# EAGLE design controller (EAGLE 9.3.0)
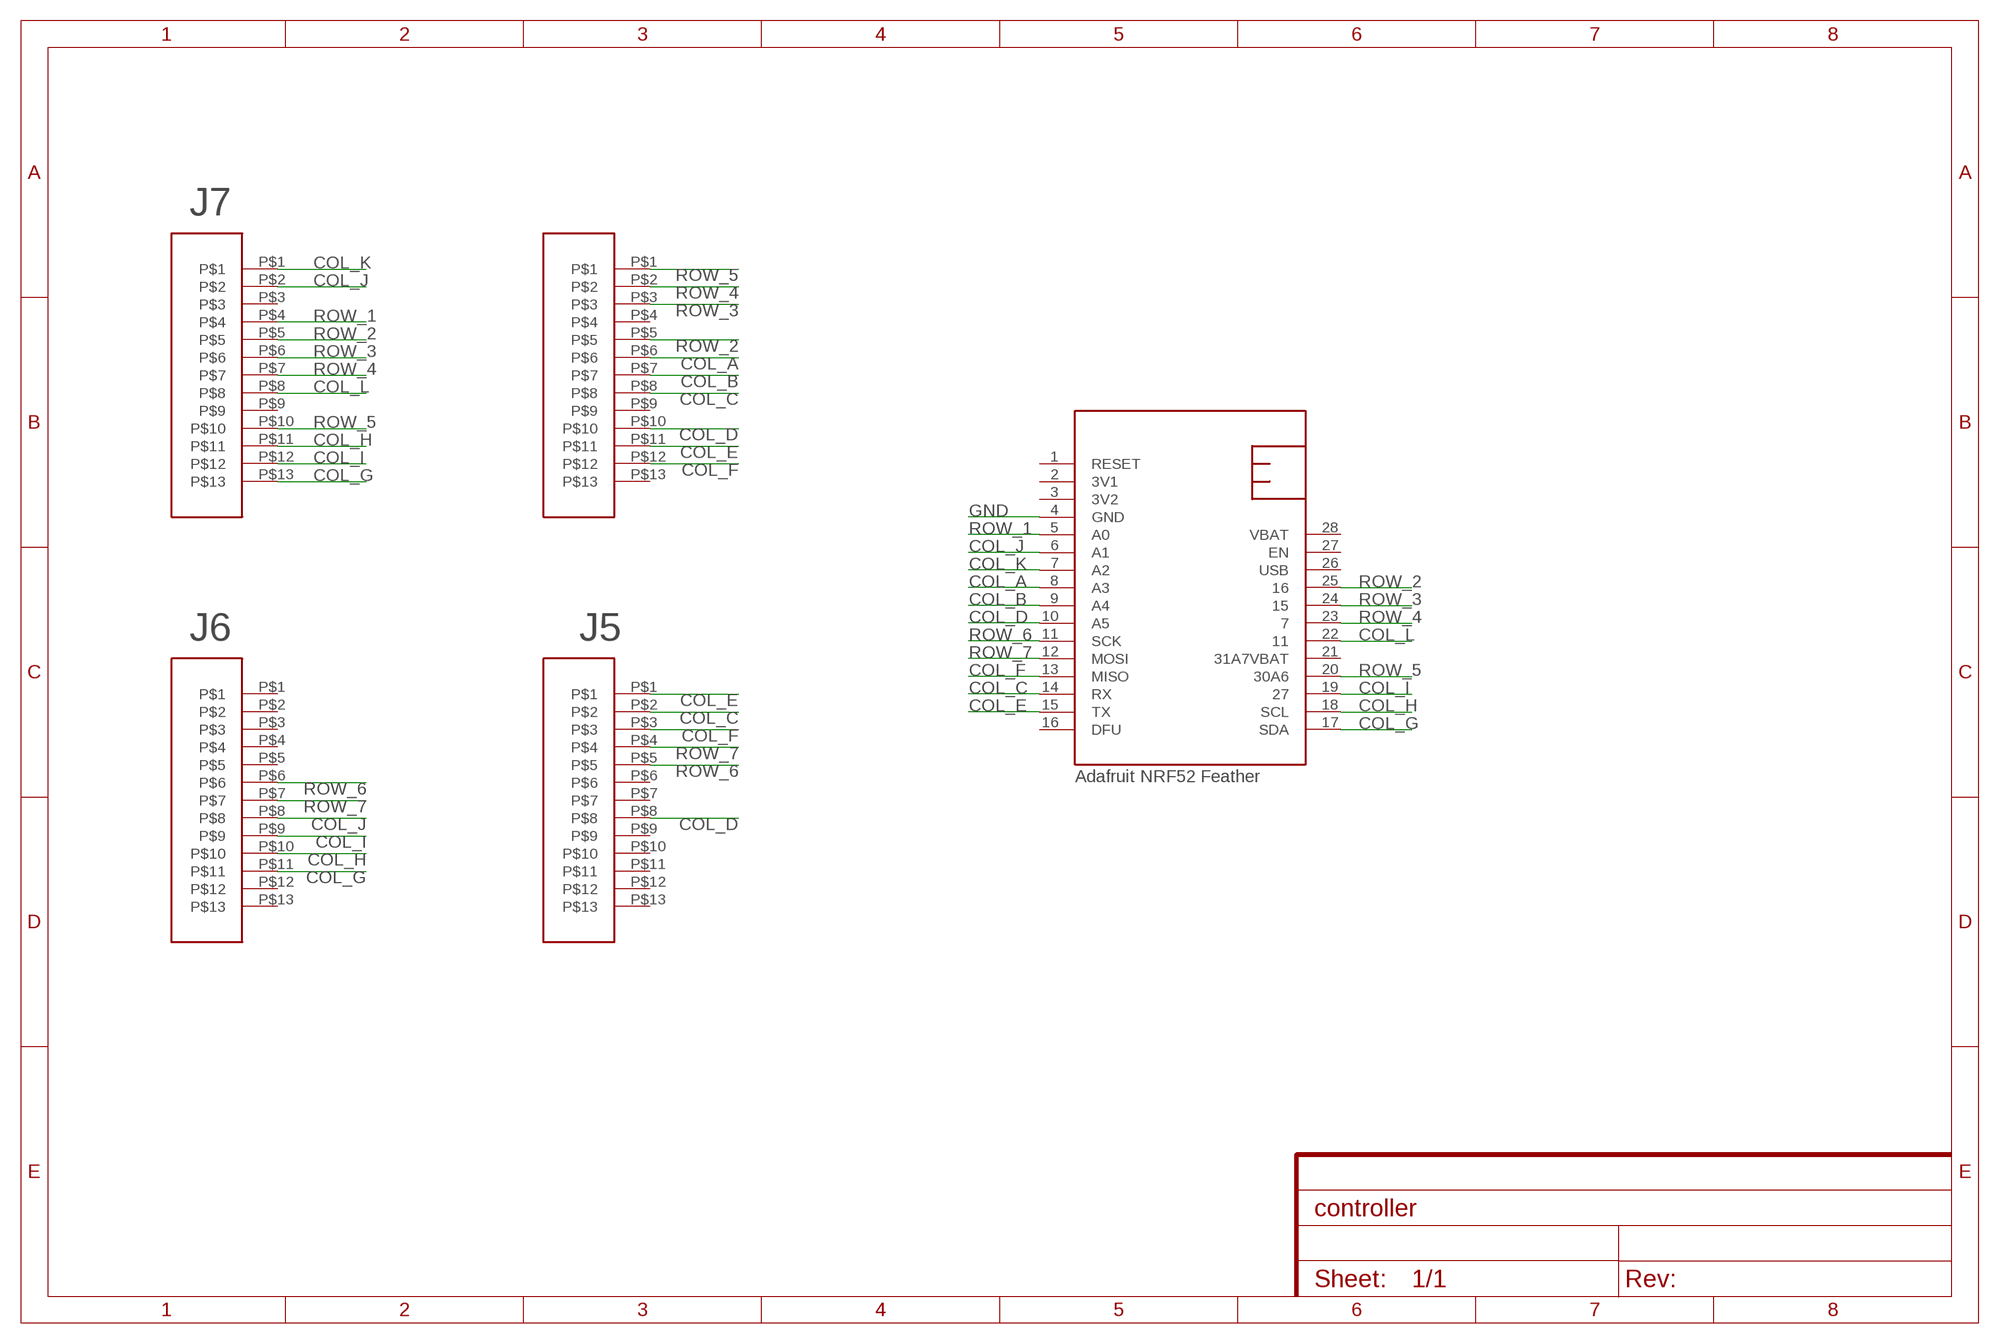
[diagram p0: schematic, sheet 1]

## Parts
U$1  NRF52FEATHER  [NRF52FEATHER]
U$4  TOPLINKS_STAPELBERG  [TOPLINKS_STAPELBERG]
U$5  TOPLINKS_STAPELBERG  [TOPLINKS_STAPELBERG]
U$6  TOPLINKS_STAPELBERG  [TOPLINKS_STAPELBERG]
U$7  TOPLINKS_STAPELBERG  [TOPLINKS_STAPELBERG]

## Nets
COL_A: U$1.8(A3) U$5.P$6
COL_B: U$1.9(A4) U$5.P$7
COL_C: U$1.14(RX) U$5.P$8 U$6.P$2
COL_D: U$1.10(A5) U$5.P$10 U$6.P$8
COL_E: U$1.15(TX) U$5.P$11 U$6.P$1
COL_F: U$1.13(MISO) U$5.P$12 U$6.P$3
COL_G: U$1.17(SDA) U$4.P$13 U$7.P$11
COL_H: U$1.18(SCL) U$4.P$11 U$7.P$10
COL_I: U$1.19 U$4.P$12 U$7.P$9
COL_J: U$1.6(A1) U$4.P$2 U$7.P$8
COL_K: U$1.7(A2) U$4.P$1
COL_L: U$1.22 U$4.P$8
GND: U$1.4(GND)
ROW_1: U$1.5(A0) U$4.P$4
ROW_2: U$1.25 U$4.P$5 U$5.P$5
ROW_3: U$1.24 U$4.P$6 U$5.P$3
ROW_4: U$1.23 U$4.P$7 U$5.P$2
ROW_5: U$1.20(30A6) U$4.P$10 U$5.P$1
ROW_6: U$1.11(SCK) U$6.P$5 U$7.P$6
ROW_7: U$1.12(MOSI) U$6.P$4 U$7.P$7
Unconnected: U$1.1(RESET) U$1.16(DFU) U$1.21(31A7VBAT) U$1.26(USB) U$1.27(EN) U$4.P$3 U$4.P$9 U$5.P$4 U$5.P$9 U$5.P$13 U$6.P$6 U$6.P$7 U$6.P$9 U$6.P$10 U$6.P$11 U$6.P$12 U$6.P$13 U$7.P$1 U$7.P$2 U$7.P$3 U$7.P$4 U$7.P$5 U$7.P$12 U$7.P$13

## Notes on the sheet
- J7
- J6 | J5
- Adafruit NRF52 Feather

## Power pins joined to a net without a drawn wire
3V1: U$1.2(3V1)
3V2: U$1.3(3V2)
VBAT: U$1.28(VBAT)

## Library data of the parts
U$1 = adafruit:NRF52FEATHER
U$4-U$7 = con-molex-39-53:TOPLINKS_STAPELBERG

## Board
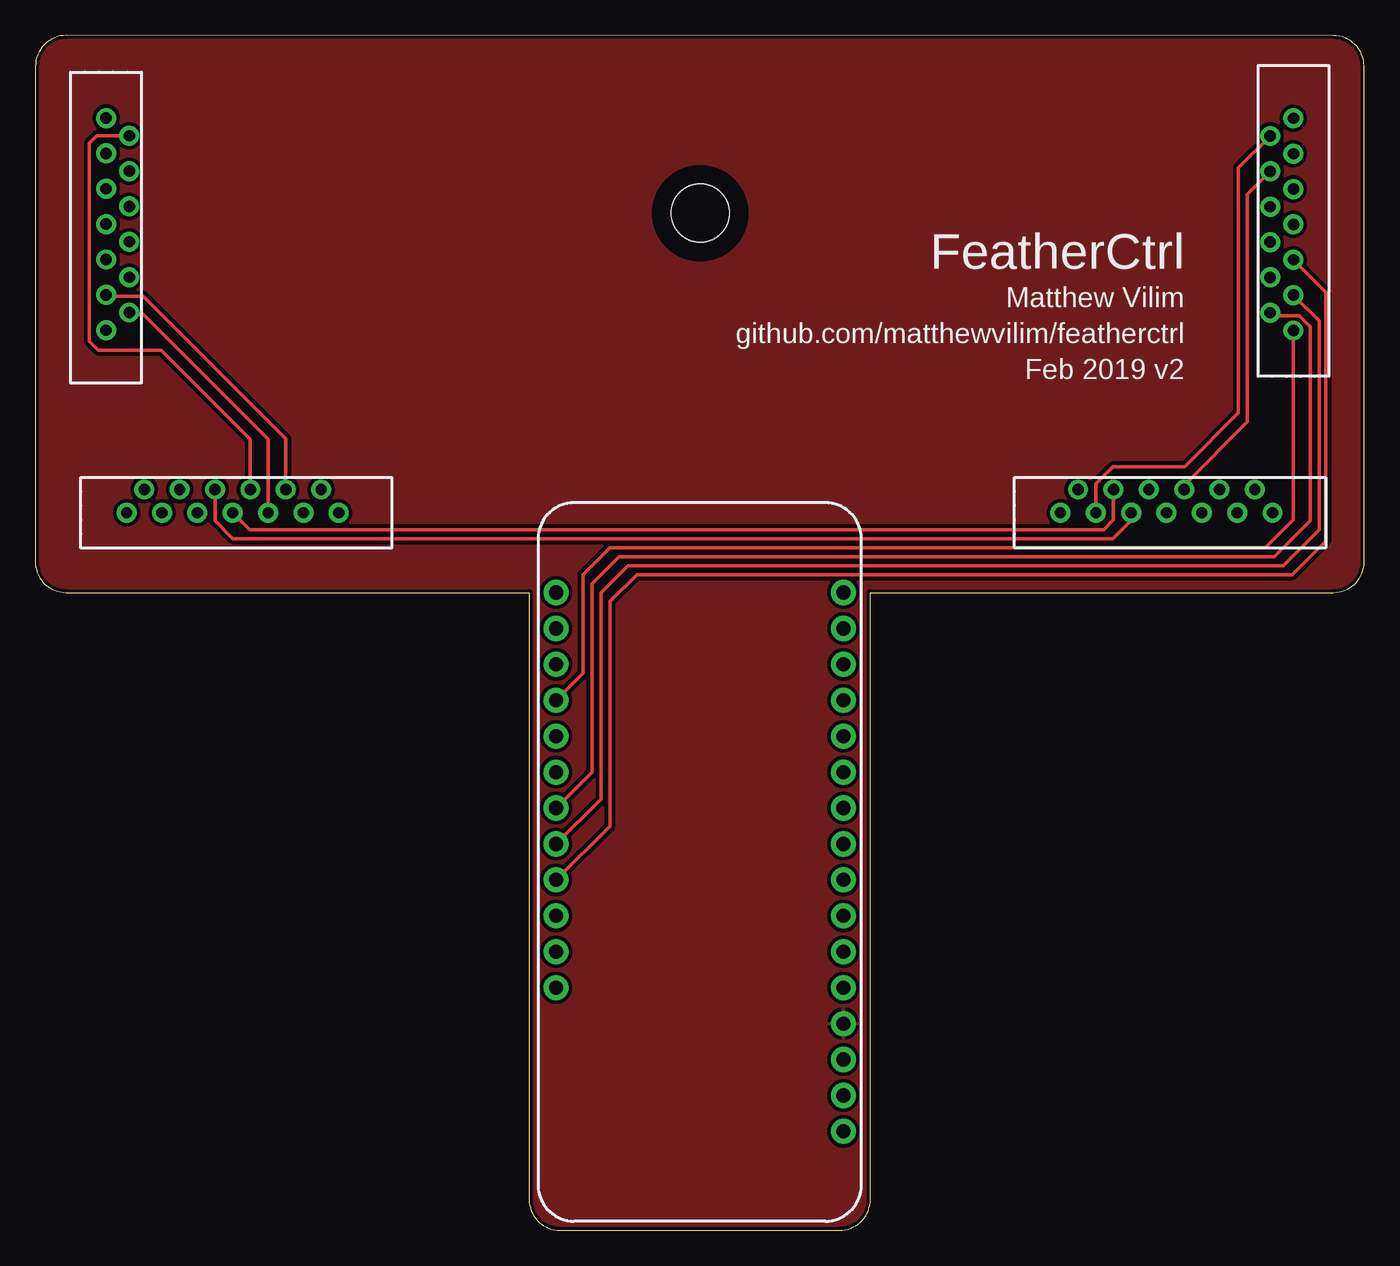
[diagram p1: board, top side]
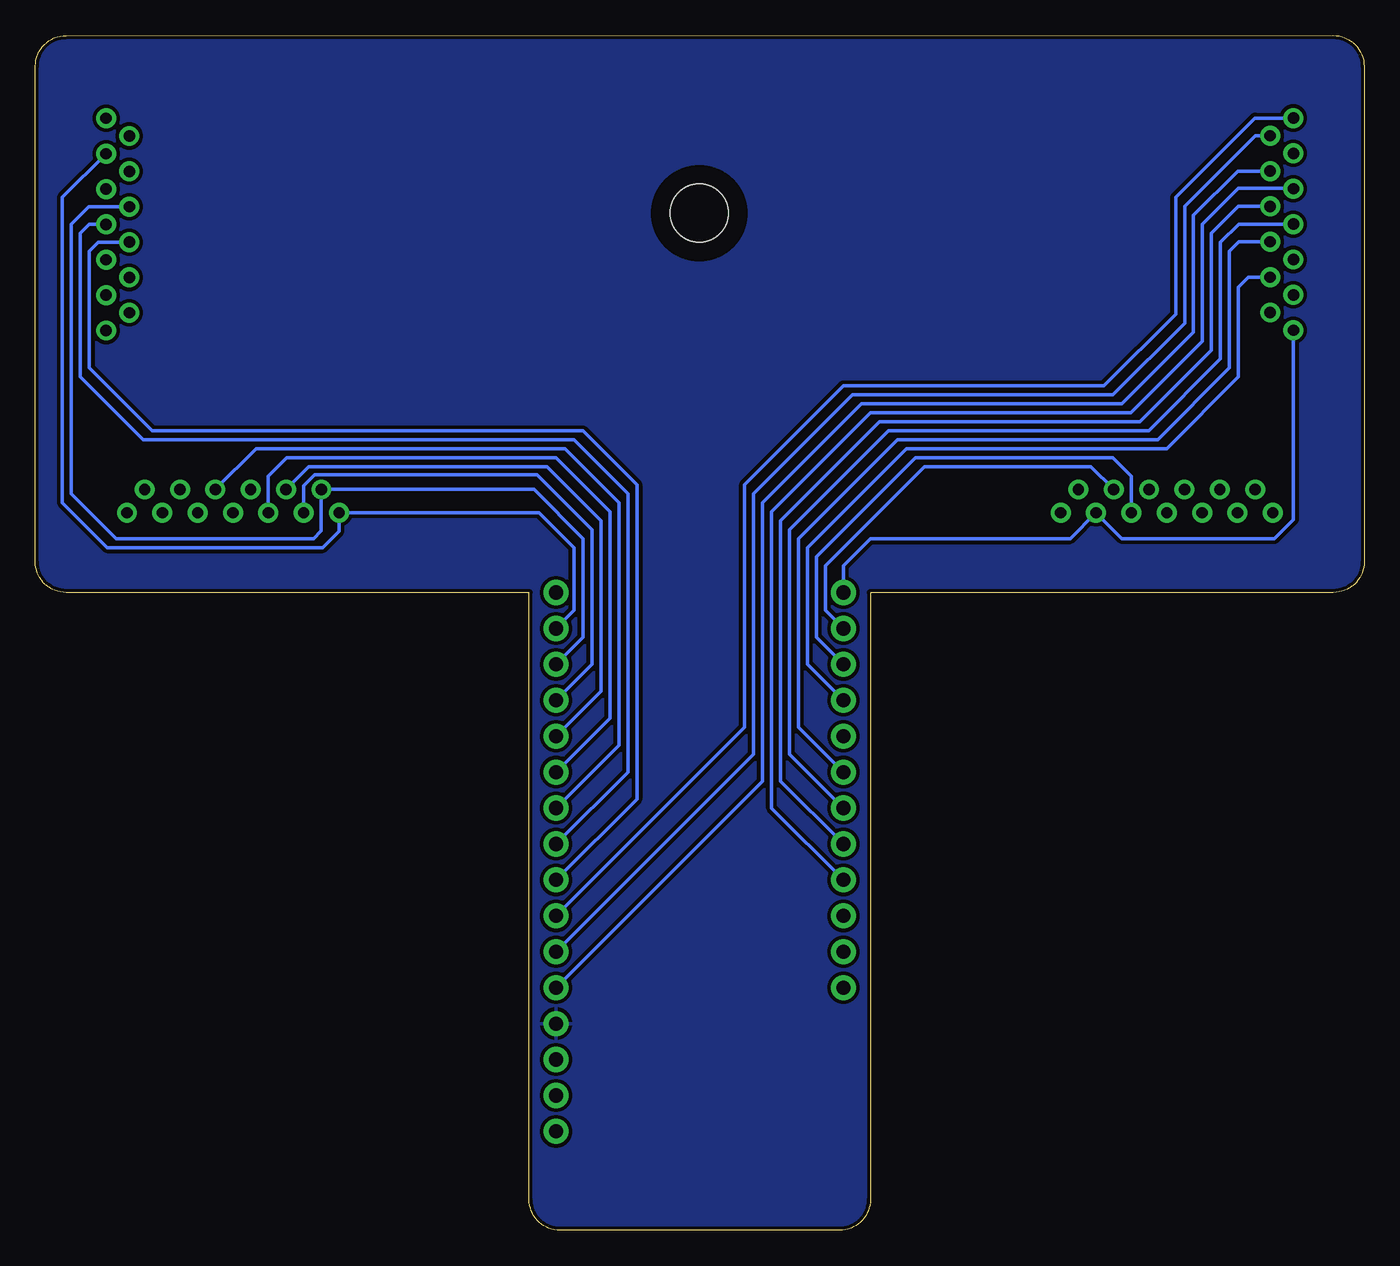
[diagram p2: board, bottom side, seen from below]

Size 93.98 x 84.48 mm. Coordinates in mm from the lower left corner, seen from the top.
Outline: 59.05,45.09 91.81,45.09 arc90 93.98,47.25 93.98,82.29 arc90 91.81,84.45 2.2,84.48 arc90 0,82.27 0,47.25 arc90 2.17,45.09 34.92,45.09 34.92,2.17 arc90 37.09,0 56.89,0 arc90 59.05,2.17 59.05,45.09
Copper layers (1*16): Top 0.035mm / dielectric 1.5mm / Bottom 0.035mm
Design rules "SparkFun": minimum track width 8mil, minimum drill 20mil, track to track 8mil, track to pad 8mil, pad to pad 8mil, via to via 8mil, smd to smd 8mil, copper to edge 10mil, drill to drill 8mil, minimum pad ring 12mil, minimum via ring 10mil, stop-mask expansion 4mil, vias tented up to drill 25mil, thermal gap 10mil
Holes 4.1 mm at 47.03,71.91
tKeepout: area 44.4,69.3 to 49.7,74.6
bKeepout: area 44.4,69.3 to 49.7,74.6
tRestrict: area 44.4,69.3 to 49.7,74.6
bRestrict: area 44.4,69.3 to 49.7,74.6
vRestrict: area 44.4,69.3 to 49.7,74.6

### Footprints (pad centres in the part's own frame; a part is rotated, then mirrored left to right if it is on the bottom)
NRF52FEATHER = drill 1 pad 1.778: 1 -17.78,-10.16; 2 -15.24,-10.16; 3 -12.7,-10.16; 4 -10.16,-10.16; 5 -7.62,-10.16; 6 -5.08,-10.16; 7 -2.54,-10.16; 8 0,-10.16; 9 2.54,-10.16; 10 5.08,-10.16; 11 7.62,-10.16; 12 10.16,-10.16; 13 12.7,-10.16; 14 15.24,-10.16; 15 17.78,-10.16; 16 20.32,-10.16; 17 20.32,10.16; 18 17.78,10.16; 19 15.24,10.16; 20 12.7,10.16; 21 10.16,10.16; 22 7.62,10.16; 23 5.08,10.16; 24 2.54,10.16; 25 0,10.16; 26 -2.54,10.16; 27 -5.08,10.16; 28 -7.62,10.16
TOPLINKS_STAPELBERG = drill 0.8: P$1 -0.08,7.51; P$2 1.57,6.26; P$3 -0.08,5.01; P$4 1.57,3.76; P$5 -0.08,2.51; P$6 1.57,1.26; P$7 -0.08,0.01; P$8 1.57,-1.24; P$9 -0.08,-2.49; P$10 1.57,-3.74; P$11 -0.08,-4.99; P$12 1.57,-6.24; P$13 -0.08,-7.49

### Placement (x,y rotation side)
U$1  46.99,24.77 90 top
U$4  5.08,71.12 0 top
U$5  88.9,71.12 180 top
U$6  80.01,50.8 90 top
U$7  13.97,50.8 90 top

### Tracks (layer width: path | path; a pad name or v marks a point on that pad's centre or on a via)
COL_A
  Bottom 0.254: U$5.P$6 89.53,69.85 90.17,69.22 90.17,60.96 85.72,56.52 55.24,56.52 51.44,52.7 51.44,30.48 U$1.8
COL_B
  Bottom 0.254: U$1.9 52.07,32.38 52.07,52.07 55.88,55.88 86.36,55.88 90.81,60.32 90.81,70.48 90.18,71.11 U$5.P$7
COL_C
  Bottom 0.254: U$5.P$8 90.2,72.36 91.44,71.12 91.44,52.07 88.27,48.89 74.3,48.89 73.75,49.44 U$6.P$2 58.72,52.37 55.24,48.89 55.24,41.91 U$1.14
COL_D
  Top 0.254: U$5.P$10 85.72,73.26 85.72,57.15 81.25,52.67 U$6.P$8
  Bottom 0.254: U$1.10 52.7,34.29 52.7,51.43 56.52,55.24 78.38,55.24 U$6.P$8
COL_E
  Bottom 0.254: U$5.P$11 92.08,73.02 92.08,51.43 88.9,48.26 73.66,48.26 72.5,49.42 U$6.P$1 58.34,50.72 55.88,48.26 55.88,43.81 U$1.15
COL_F
  Top 0.254: U$5.P$12 85.09,75.12 85.09,57.78 81.28,53.98 76.2,53.98 75,52.77 U$6.P$3
  Bottom 0.254: U$1.13 54.61,40 54.61,49.53 58.48,53.41 74.23,53.41 75,52.63 U$6.P$3
COL_G
  Bottom 0.254: U$4.P$13 5,50.24 6.35,48.89 17.14,48.89 U$7.P$11 20.79,48.89 34.92,48.89 36.83,46.99 U$1.17
COL_H
  Top 0.254: U$4.P$11 5.09,66.04 7.62,66.04 17.71,55.95 U$7.P$10
  Bottom 0.254: U$1.18 38.1,43.81 38.1,46.99 31.11,53.98 19.32,53.98 U$7.P$10
COL_I
  Top 0.254: U$4.P$12 6.76,64.77 7.62,64.77 16.46,55.93 U$7.P$9
  Bottom 0.254: U$1.19 38.73,41.91 38.73,47.62 31.75,54.61 17.78,54.61 16.46,53.29 U$7.P$9
COL_J
  Top 0.254: U$4.P$2 4.36,77.38 3.81,76.84 3.81,62.86 4.45,62.23 8.89,62.23 15.21,55.91 U$7.P$8
  Bottom 0.254: U$1.6 43.18,33.66 43.18,52.07 36.2,59.05 17.78,59.05 12.7,64.14 12.7,71.12 12.7,71.33 12.7,72.39 7.71,77.38 U$4.P$2
COL_K
  Bottom 0.254: U$1.7 43.81,35.56 43.81,52.7 36.83,59.69 18.41,59.69 13.34,64.77 13.34,73.03 7.73,78.63 U$4.P$1
COL_L
  Bottom 0.254: U$1.22 40.01,35.56 40.01,48.89 33.02,55.88 14.61,55.88 9.53,60.96 9.53,69.22 8.86,69.88 U$4.P$8
GND
  pour Top (isolate 0.254): 91.81,84.45 2.17,84.45 arc90 0,82.29 0,47.25 arc90 2.17,45.09 34.92,45.09 34.92,2.17 arc90 37.09,0 56.89,0 arc90 59.05,2.17 59.05,45.09 91.81,45.09 arc90 93.98,47.25 93.98,82.29 arc90
  pour Bottom (isolate 0.254): 34.92,45.09 2.17,45.09 arc-90 0,47.25 0,82.29 arc-90 2.17,84.45 91.81,84.45 arc-90 93.98,82.29 93.98,47.25 arc-90 91.81,45.09 59.05,45.09 59.05,2.17 arc-90 56.89,0 37.09,0 arc-90 34.92,2.17
ROW_1
  Bottom 0.254: U$1.5 42.55,31.75 42.55,51.43 35.56,58.42 17.14,58.42 12.06,63.5 12.06,71.76 8.94,74.88 U$4.P$4
ROW_2
  Top 0.254: U$1.25 40.64,28.58 40.64,44.45 42.55,46.35 88.9,46.35 91.26,48.72 91.26,66.33 U$5.P$5
  Bottom 0.254: U$1.25 41.91,29.85 41.91,50.8 34.92,57.78 16.51,57.78 11.43,62.86 11.43,71.12 8.89,73.66 5.03,73.66 U$4.P$5
ROW_3
  Top 0.254: U$5.P$3 90.81,64.28 90.81,49.53 88.27,46.99 41.91,46.99 40.01,45.09 40.01,30.48 U$1.24
  Bottom 0.254: U$1.24 41.27,31.75 41.27,50.16 34.29,57.15 15.88,57.15 10.79,62.23 10.79,70.48 8.89,72.39 U$4.P$6
ROW_4
  Top 0.254: U$5.P$2 87.55,64.65 89.41,64.65 90.17,63.88 90.17,50.16 87.63,47.62 41.27,47.62 39.37,45.72 39.37,32.38 U$1.23
  Bottom 0.254: U$1.23 40.64,33.66 40.64,49.53 33.66,56.52 15.24,56.52 10.16,61.59 10.16,69.85 8.88,71.13 U$4.P$7
ROW_5
  Top 0.254: U$5.P$1 88.98,50.24 87,48.26 40.64,48.26 38.73,46.35 38.73,39.37 U$1.20
  Bottom 0.254: U$1.20 39.37,40 39.37,48.26 32.38,55.24 13.97,55.24 8.89,60.32 8.89,65.14 8.89,66.68 8.19,67.38 U$4.P$10
ROW_6
  Top 0.254: U$7.P$6 12.71,50.16 13.97,48.89 76.2,48.89 77.5,50.2 U$6.P$5
  Bottom 0.254: U$1.11 53.34,36.2 53.34,50.8 57.15,54.61 76.2,54.61 77.5,53.31 U$6.P$5
ROW_7
  Top 0.254: U$6.P$4 76.25,50.21 75.56,49.53 15.15,49.53 U$7.P$7
  Bottom 0.254: U$1.12 53.98,38.1 53.98,50.16 57.78,53.98 74.64,53.98 U$6.P$4

### Text on the board
tPlace: FeatherCtrl | Matthew Vilim | github.com/matthewvilim/featherctrl | Feb 2019 v2